# EAGLE schematic shield (EAGLE 5.06)
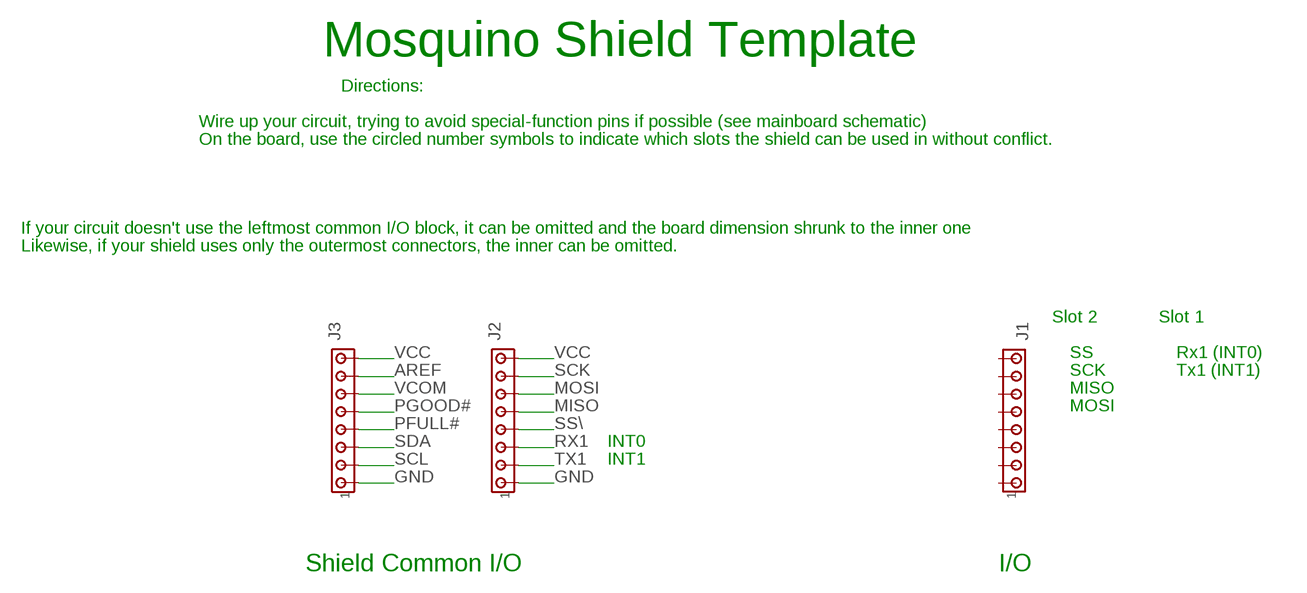
[diagram p0: schematic, sheet 1]

## Parts
J1  MTA08-100  [10X08MTA]
J2  MTA08-100  [10X08MTA]
J3  MTA08-100  [10X08MTA]

## Nets
AREF: J3.7
GND: J2.1 J3.1
MISO: J2.5
MOSI: J2.6
PFULL#: J3.4
PGOOD#: J3.5
RX1: J2.3
SCK: J2.7
SCL: J3.2
SDA: J3.3
SS\: J2.4
TX1: J2.2
VCC: J2.8 J3.8
VCOM: J3.6
Unconnected: J1.1 J1.2 J1.3 J1.4 J1.5 J1.6 J1.7 J1.8

## Notes on the sheet
- Mosquino Shield Template
- Directions:
- Wire up your circuit, trying to avoid special-function pins if possible (see mainboard schematic)
- On the board, use the circled number symbols to indicate which slots the shield can be used in without conflict.
- If your circuit doesn't use the leftmost common I/O block, it can be omitted and the board dimension shrunk to the inner one
- Likewise, if your shield uses only the outermost connectors, the inner can be omitted.
- Slot 2 | Slot 1
- SS | Rx1 (INT0)
- SCK | Tx1 (INT1)
- MISO
- MOSI
- INT0
- INT1
- Shield Common I/O | I/O

## Library data of the parts
J1-J3 = con-amp:MTA08-100: AMP connector

## Net classes
1 pwr: width 0.305 mm, drill 0.508 mm, clearance 0.203 mm
4 digital: width 0.203 mm, drill 0.381 mm, clearance 0.203 mm